# Altium schematic sheet tcpcontrol.SchDoc
size A3; Organization: Altium Limited; Address1: L3, 12a Rodborough Rd; Address2: Frenchs Forest; Address3: NSW; Address4: Australia 2086
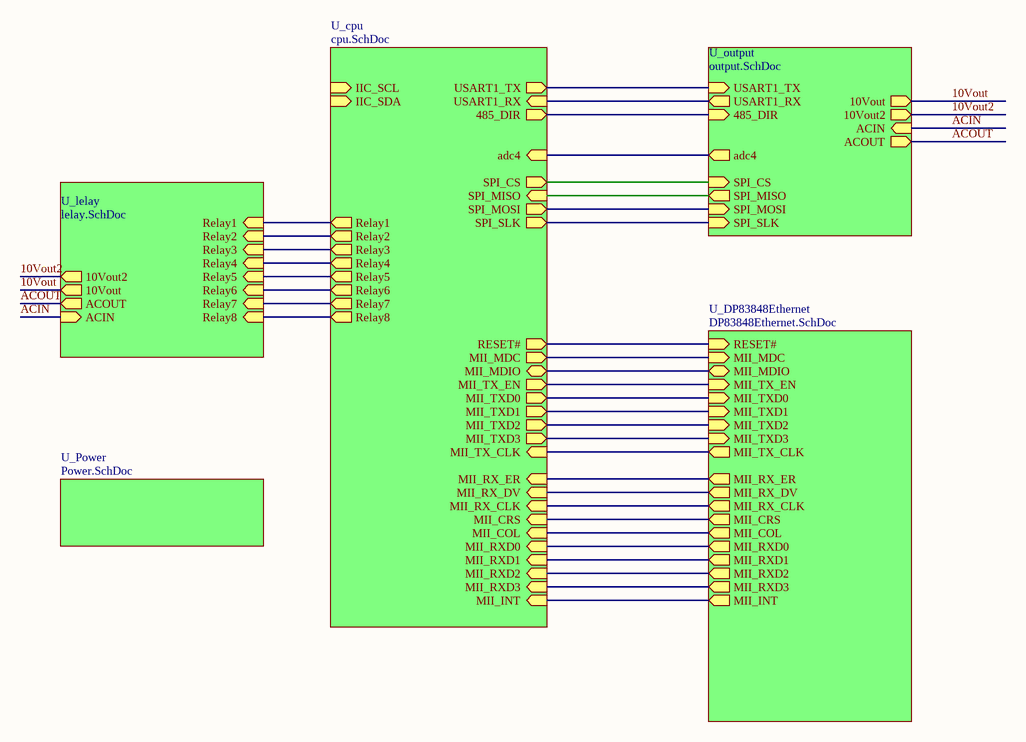
[diagram p0: tcpcontrol.SchDoc]

## Sub-sheets
U_cpu = cpu.SchDoc: USART1_TX (out), USART1_RX (in), Relay1 (out), Relay2 (out), 485_DIR (out), IIC_SCL (in), IIC_SDA (in), Relay3 (out), Relay4 (out), Relay8 (out), Relay7 (out), Relay5 (out), Relay6 (out), SPI_CS (out), SPI_MOSI (out), SPI_SLK (out), SPI_MISO (in), MII_TXD0 (out), MII_RX_ER (in), MII_RXD0 (in), MII_MDC (out), MII_MDIO (bidir), MII_RXD2 (in), MII_RX_DV (in), MII_TX_CLK (in), MII_TX_EN (out), MII_RXD3 (in), MII_RXD1 (in), MII_TXD3 (out), MII_INT (in), adc4 (in), RESET# (out), MII_CRS (in), MII_COL (in), MII_RX_CLK (in), MII_TXD1 (out), MII_TXD2 (out)
U_DP83848Ethernet = DP83848Ethernet.SchDoc: MII_TXD0 (in), MII_TX_EN (in), MII_TX_CLK (out), MII_RXD0 (out), MII_RX_ER (out), MII_RX_DV (out), MII_RX_CLK (out), MII_COL (out), MII_CRS (out), MII_MDC (in), MII_MDIO (bidir), RESET# (in), MII_TXD1 (in), MII_TXD2 (in), MII_TXD3 (in), MII_RXD1 (out), MII_RXD2 (out), MII_RXD3 (out), MII_INT (out)
U_lelay = lelay.SchDoc: Relay1 (in), Relay2 (in), Relay3 (in), Relay4 (in), Relay5 (in), Relay6 (in), Relay7 (in), Relay8 (in), 10Vout2 (out), 10Vout (out), ACOUT (out), ACIN (in)
U_output = output.SchDoc: USART1_TX (in), USART1_RX (out), 485_DIR (in), 10Vout2 (out), ACIN (in), ACOUT (out), 10Vout (out), SPI_CS (in), SPI_MISO (out), SPI_SLK (in), SPI_MOSI (in), adc4 (out)
U_Power = Power.SchDoc: no entries

## Nets
10Vout: sheet U_lelay/10Vout, sheet U_output/10Vout
10Vout2: sheet U_lelay/10Vout2, sheet U_output/10Vout2
ACIN: sheet U_lelay/ACIN, sheet U_output/ACIN
ACOUT: sheet U_lelay/ACOUT, sheet U_output/ACOUT
(unnamed): sheet U_cpu/USART1_TX, sheet U_output/USART1_TX
(unnamed): sheet U_cpu/USART1_RX, sheet U_output/USART1_RX
(unnamed): sheet U_cpu/Relay1, sheet U_lelay/Relay1
(unnamed): sheet U_cpu/Relay2, sheet U_lelay/Relay2
(unnamed): sheet U_cpu/485_DIR, sheet U_output/485_DIR
(unnamed): sheet U_cpu/Relay3, sheet U_lelay/Relay3
(unnamed): sheet U_cpu/Relay4, sheet U_lelay/Relay4
(unnamed): sheet U_cpu/Relay8, sheet U_lelay/Relay8
(unnamed): sheet U_cpu/Relay7, sheet U_lelay/Relay7
(unnamed): sheet U_cpu/Relay5, sheet U_lelay/Relay5
(unnamed): sheet U_cpu/Relay6, sheet U_lelay/Relay6
(unnamed): sheet U_cpu/SPI_CS, sheet U_output/SPI_CS
(unnamed): sheet U_cpu/SPI_MOSI, sheet U_output/SPI_MOSI
(unnamed): sheet U_cpu/SPI_SLK, sheet U_output/SPI_SLK
(unnamed): sheet U_cpu/SPI_MISO, sheet U_output/SPI_MISO
(unnamed): sheet U_cpu/MII_TXD0, sheet U_DP83848Ethernet/MII_TXD0
(unnamed): sheet U_cpu/MII_RX_ER, sheet U_DP83848Ethernet/MII_RX_ER
(unnamed): sheet U_cpu/MII_RXD0, sheet U_DP83848Ethernet/MII_RXD0
(unnamed): sheet U_cpu/MII_MDC, sheet U_DP83848Ethernet/MII_MDC
(unnamed): sheet U_cpu/MII_MDIO, sheet U_DP83848Ethernet/MII_MDIO
(unnamed): sheet U_cpu/MII_RXD2, sheet U_DP83848Ethernet/MII_RXD2
(unnamed): sheet U_cpu/MII_RX_DV, sheet U_DP83848Ethernet/MII_RX_DV
(unnamed): sheet U_cpu/MII_TX_CLK, sheet U_DP83848Ethernet/MII_TX_CLK
(unnamed): sheet U_cpu/MII_TX_EN, sheet U_DP83848Ethernet/MII_TX_EN
(unnamed): sheet U_cpu/MII_RXD3, sheet U_DP83848Ethernet/MII_RXD3
(unnamed): sheet U_cpu/MII_RXD1, sheet U_DP83848Ethernet/MII_RXD1
(unnamed): sheet U_cpu/MII_TXD3, sheet U_DP83848Ethernet/MII_TXD3
(unnamed): sheet U_cpu/MII_INT, sheet U_DP83848Ethernet/MII_INT
(unnamed): sheet U_cpu/adc4, sheet U_output/adc4
(unnamed): sheet U_cpu/RESET#, sheet U_DP83848Ethernet/RESET#
(unnamed): sheet U_cpu/MII_CRS, sheet U_DP83848Ethernet/MII_CRS
(unnamed): sheet U_cpu/MII_COL, sheet U_DP83848Ethernet/MII_COL
(unnamed): sheet U_cpu/MII_RX_CLK, sheet U_DP83848Ethernet/MII_RX_CLK
(unnamed): sheet U_cpu/MII_TXD1, sheet U_DP83848Ethernet/MII_TXD1
(unnamed): sheet U_cpu/MII_TXD2, sheet U_DP83848Ethernet/MII_TXD2

## Notes on the sheet
- Title
- Size:
- Date:
- A3
- Number:
- Time:
- Revision:
- Sheet
- of
- File: